# EAGLE schematic CityFireFly (EAGLE 7.5.0)
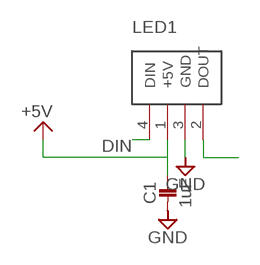
[diagram p0: schematic, sheet 1]

## Parts
C1  1uF  1005  [1005]
LED1  NEO_FLAT  [NEO_FLAT]

## Nets
+5V: C1.1 LED1.1(+5V)
DIN: LED1.4(DIN)
DOUT: LED1.2(DOUT)
GND: C1.2 LED1.3(GND)

## Library data of the parts
C1 = 02_C:1005
LED1 = 10_LED:NEO_FLAT